# Altium schematic sheet N-FET Driver.SchDoc
size A4
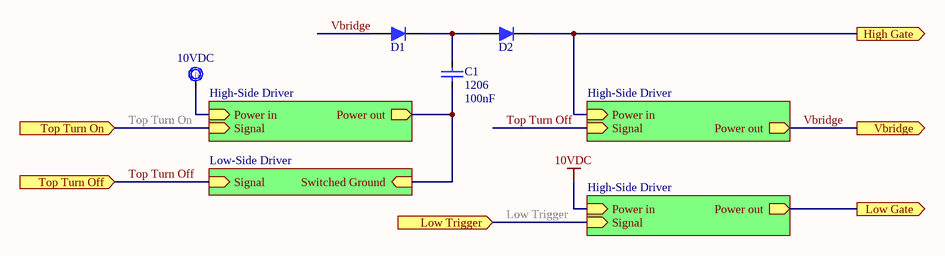
[diagram p0: N-FET Driver.SchDoc]

## Parts
10VDC  Test Point  [Test Pad Large]  (value not drawn)  (no BOM)
C1  1206  Capacitance: 100nF  [Capacitor - 1206 Ceramic]
D1  Diode - Signal 1A  [SMA - Diode]  (value not drawn)
D2  Diode - Signal 1A  [SMA - Diode]  (value not drawn)

## Sub-sheets
High-Side Driver = High-Side Driver.SchDoc: Signal (in), Power out (out), Power in (in)
High-Side Driver = High-Side Driver.SchDoc: Signal (in), Power out (out), Power in (in)
High-Side Driver = High-Side Driver.SchDoc: Signal (in), Power out (out), Power in (in)
Low-Side Driver = Low-Side Driver.SchDoc: Signal (in), Switched Ground (in)

## Ports
High Gate (out), Low Gate (out), Low Trigger (in), Top Turn Off (in), Top Turn On (in), Vbridge (out)

## Nets
10VDC: sheet High-Side Driver/Power in
High Gate: D2.2(Cathode) ; port High Gate, sheet High-Side Driver/Power in
Low Gate: port Low Gate, sheet High-Side Driver/Power out
Low Trigger: port Low Trigger, sheet High-Side Driver/Signal
Top Turn Off: port Top Turn Off, sheet High-Side Driver/Signal, sheet Low-Side Driver/Signal
Top Turn On: port Top Turn On, sheet High-Side Driver/Signal
Vbridge: D1.1(Anode) ; port Vbridge, sheet High-Side Driver/Power out
Net10VDC_1: 10VDC.1 ; sheet High-Side Driver/Power in
NetC1_1: C1.1 D1.2(Cathode) D2.1(Anode)
NetC1_2: C1.2 ; sheet High-Side Driver/Power out, sheet Low-Side Driver/Switched Ground

## Notes on the sheet
- Change Log:
  Rev A	[Date]	[Name]
  Initial Design
- Notes on design choices, considerations for use, and other information
- Notes that affect design layout, including considerations and non-rule restrictions
- Notes that regard circuit capabilities, max/recommended currents, voltages, etc
- Cct
- Designed by
- Rev
- Date
- Sheet       of
- (in symbol Test Point) Point; Test

## Library data of the parts
C1 = 100nF 1206 50V: Non-polarized; Manufacturer: Kemet; Manufacturer Part Number: C1206C104K5RAC7867; Value: 100 nF 50V 1206 X7R 10%; Tolerance: ±10%; Voltage - Rated: 50V; Temperature Coefficient: X7R; Price P/N: 020101-001; Technology: SMT; Supplier 1: Digi-Key; RoHS: RoHS Compliant; Category: Capacitors; Stock 1: 910232; Pricing 1: 1=0.13, 10=0.095, 25=0.068, 50=0.052, 100=0.044, 250=0.036, 1000=0.02351 (CAD); Packaging: Cut Tape (CT); Mounting Type: Surface Mount, MLCC; Operating Temperature: -55°C ~ 125°C; Applications: General Purpose; Ratings: -; Package / Case: 1206 (3216 Metric); Size / Dimension: 0.126" L x 0.063" W (3.20mm x 1.60mm); Height - Seated (Max): -; Thickness (Max): 0.035" (0.88mm); Lead Spacing: -; Features: -; Lead Style: -; ComponentLink1URL: http://www.kemet.com/docfinder?Partnumber=C1206C104K5RACTU; ComponentLink1Description: Spec Sheet; Supplier Part Number 1: 399-1249-1-ND
D1 D2 = Diode - Signal 1A: Signal Diode; Manufacturer: Fairchild Semiconductor; Manufacturer Part Number: RS1M; Diode Type: Standard; Voltage - DC Reverse (Vr) (Max): 1000V (1kV); Voltage - Forward (Vf) (Max) @ If: 1.3V @ 1A; Speed: Fast Recovery =< 500ns, > 200mA (Io); Reverse Recovery Time (trr): 500ns; Current - Reverse Leakage @ Vr: 5µA @ 1000V; Capacitance @ Vr, F: 10pF @ 4V, 1MHz; Price P/N: 020107-002; Technology: SMT; Value: Signal Diode; Supplier 1: Digi-Key; Supplier Part Number 1: RS1MFSCT-ND; RoHS: RoHS Compliant; Category: Discrete Semiconductor Products; Stock 1: 3125; Pricing 1: 1=0.47, 10=0.339, 25=0.2632, 100=0.1993, 250=0.14092, 500=0.11282, 1000=0.08654, 2500=0.07522 (CAD); Packaging: Cut Tape (CT); Current - Average Rectified (Io): 1A; Mounting Type: Surface Mount; Package / Case: DO-214AC, SMA; Supplier Device Package: SMA (DO-214AC); Operating Temperature - Junction: -55°C ~ 150°C; ComponentLink1URL: http://www.fairchildsemi.com/datasheets/RS/RS1M.pdf; ComponentLink1Description: Spec Sheet